# EAGLE schematic VMU (EAGLE 8.2.1)
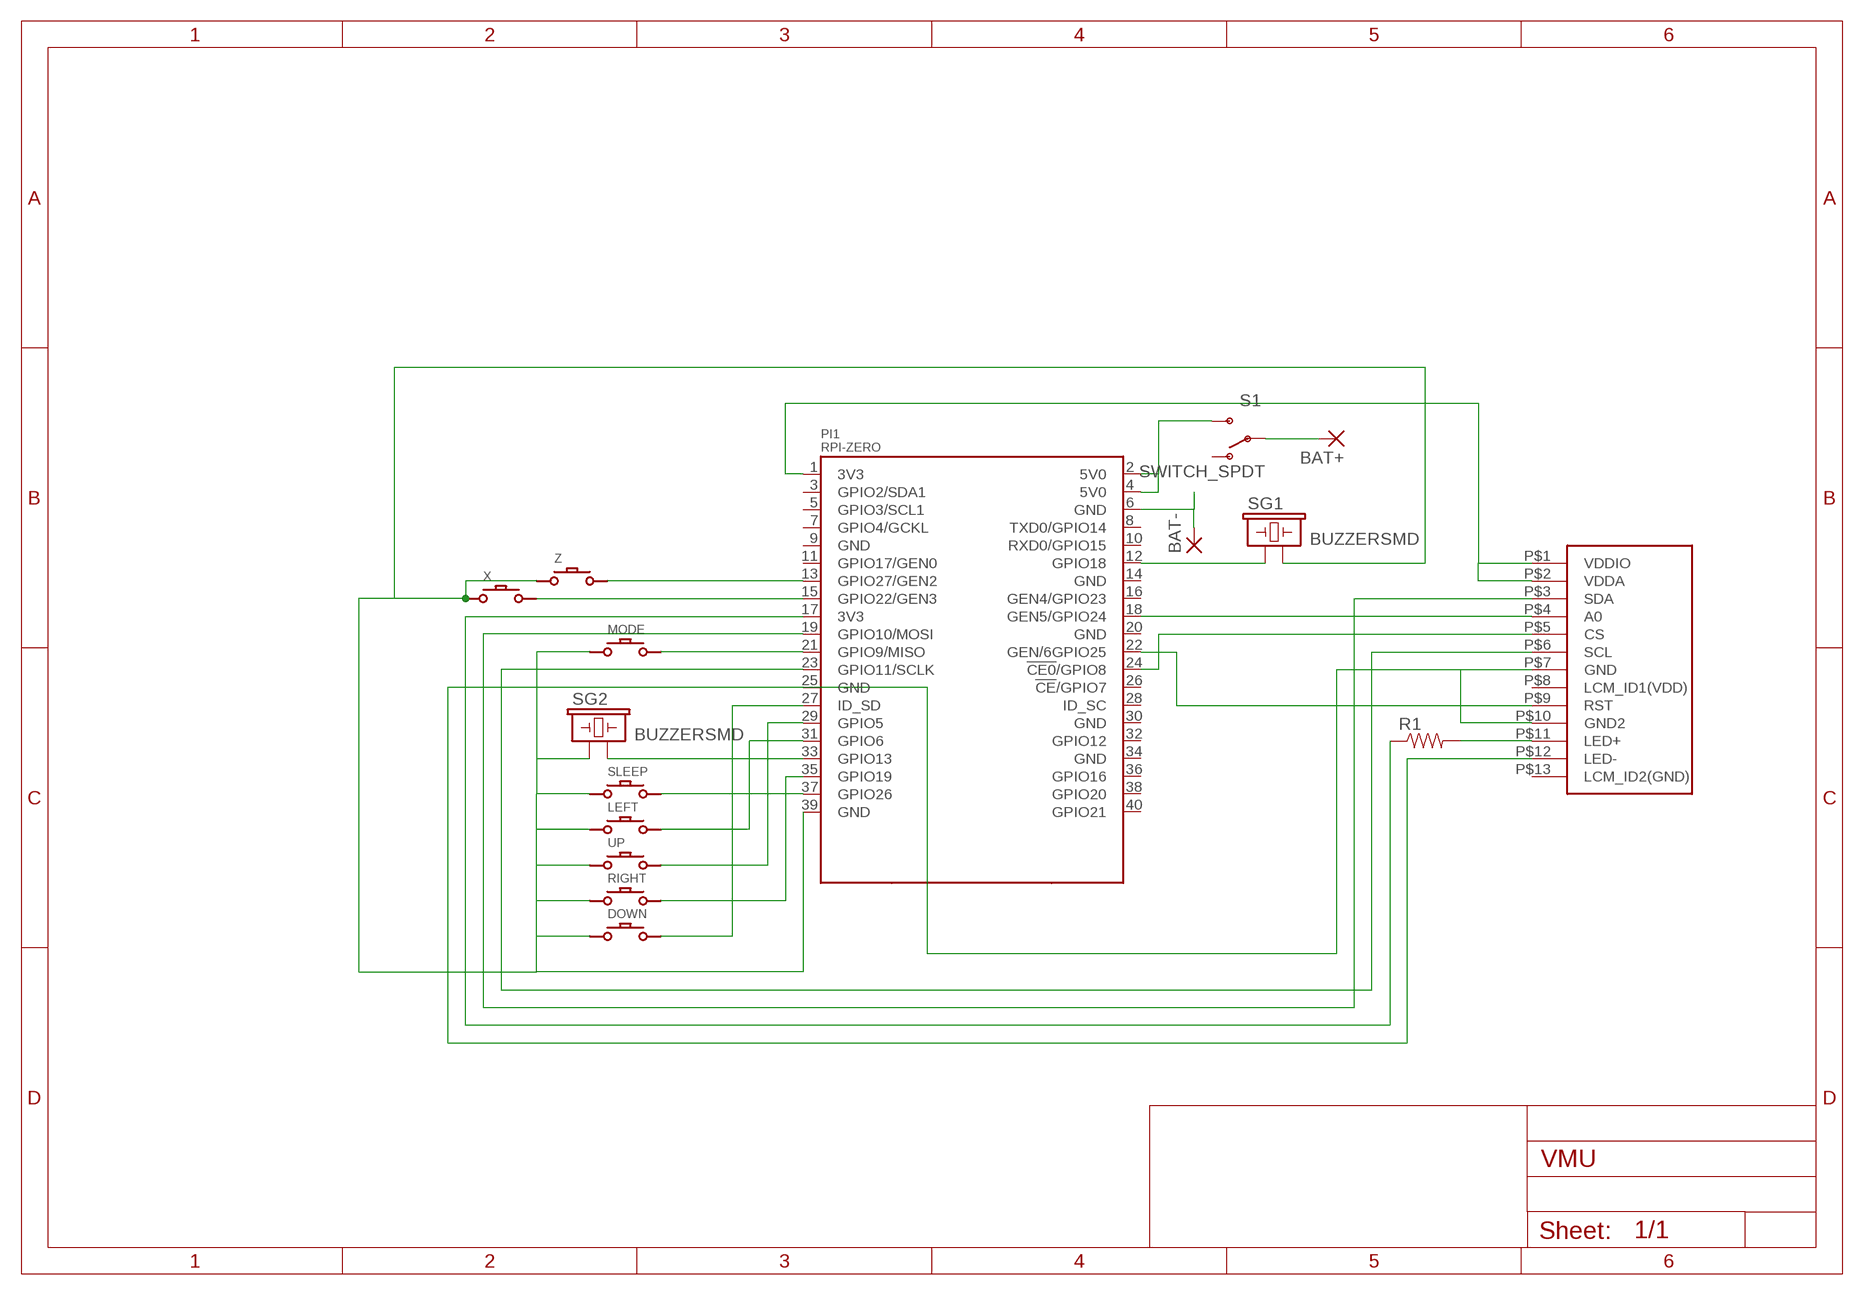
[diagram p0: schematic, sheet 1]

## Parts
BAT+  SMD5  [SMD2,54-5,08]
BAT-  SMD5  [SMD2,54-5,08]
DOWN  DMG-BTNDS-BUTTON  [DS-LITE-BTN]
LEFT  DMG-BTNDS-BUTTON  [DS-LITE-BTN]
MODE  DMG-BTNDS-BUTTON  [DS-LITE-BTN]
PI1  RPI-ZERO  [RASPBERRYPI_BASTELSTUBE_V13_RASPI_BOARD_B+_FULL]
R1  RESISTOR0805-RES  [0805]
RIGHT  DMG-BTNDS-BUTTON  [DS-LITE-BTN]
S1  SWITCH_SPDT  [KPS-1290]
SG1  BUZZERSMD  [BUZZER-CMT1603]
SG2  BUZZERSMD  [BUZZER-CMT1603]
SLEEP  DMG-BTNDS-BUTTON  [DS-LITE-BTN]
U$1  ST7735S-1.44  [ST7735S-1.44]
UP  DMG-BTNDS-BUTTON  [DS-LITE-BTN]
X  DMG-BTNDS-BUTTON  [DS-LITE-BTN]
Z  DMG-BTNDS-BUTTON  [DS-LITE-BTN]

## Nets
3V3@1: PI1.1(3V3) U$1.P$1(VDDIO) U$1.P$2(VDDA)
3V3@2: PI1.17(3V3) R1.1
5V0@2: PI1.2(5V0) PI1.4(5V0) S1.S
GND@2: PI1.25(GND) U$1.P$7(GND) U$1.P$10(GND2) U$1.P$12(LED-)
GND@3: DOWN.P$3 LEFT.P$3 MODE.P$3 PI1.39(GND) RIGHT.P$3 SG1.P$2 SG2.P$1 SLEEP.P$3 UP.P$3 X.P$3 Z.P$3
GND@8: BAT-.1(P) PI1.6(GND)
N$1: PI1.22(GEN/6GPIO25) U$1.P$9(RST)
N$2: PI1.23(GPIO11/SCLK) U$1.P$6(SCL)
N$3: PI1.19(GPIO10/MOSI) U$1.P$3(SDA)
N$4: PI1.37(GPIO26) SLEEP.P$4
N$5: PI1.35(GPIO19) RIGHT.P$4
N$6: PI1.18(GEN5/GPIO24) U$1.P$4(A0)
N$7: PI1.24(!CE0!/GPIO8) U$1.P$5(CS)
N$8: LEFT.P$4 PI1.31(GPIO6)
N$9: PI1.29(GPIO5) UP.P$4
N$10: DOWN.P$4 PI1.27(ID_SD)
N$11: MODE.P$4 PI1.21(GPIO9/MISO)
N$12: PI1.13(GPIO27/GEN2) Z.P$4
N$13: PI1.12(GPIO18) SG1.P$1
N$14: R1.2 U$1.P$11(LED+)
N$15: PI1.33(GPIO13) SG2.P$2
N$16: PI1.15(GPIO22/GEN3) X.P$4
N$21: BAT+.1(P) S1.P
Unconnected: PI1.3(GPIO2/SDA1) PI1.5(GPIO3/SCL1) PI1.7(GPIO4/GCKL) PI1.8(TXD0/GPIO14) PI1.9(GND) PI1.10(RXD0/GPIO15) PI1.11(GPIO17/GEN0) PI1.14(GND) PI1.16(GEN4/GPIO23) PI1.20(GND) PI1.26(!CE!/GPIO7) PI1.28(ID_SC) PI1.30(GND) PI1.32(GPIO12) PI1.34(GND) PI1.36(GPIO16) PI1.38(GPIO20) PI1.40(GPIO21) S1.O U$1.P$8(LCM_ID1(VDD)) U$1.P$13(LCM_ID2(GND))

## Library data of the parts
BAT+ BAT- = wirepad:SMD5: SMD PAD
DOWN LEFT MODE RIGHT SLEEP UP X Z = Game_Boy:DMG-BTN
PI1 = RPI-Zero:RPI-ZERO
R1 = SparkFun-Resistors:RESISTOR: Resistor Basic schematic elements and footprints for 0603, 1206, and PTH resistors.
S1 = SparkFun-Electromechanical:SWITCH_SPDT: SWCH-10651 Side-actuated SPDT slide switch, as used on the Arduino Pro; PROD_ID: SWCH-10651
SG1 SG2 = SparkFun-Electromechanical:BUZZER: Buzzer 12mm Spark Fun Electronics SKU : Comp-Buzzer
U$1 = ST7735S:ST7735S-1.44